# Altium schematic sheet logi-cam.SchDoc: PMOD Camera Adapter
size A; Engineer: Michael Jones; Revision: RA.1; ProjectName: OV7725
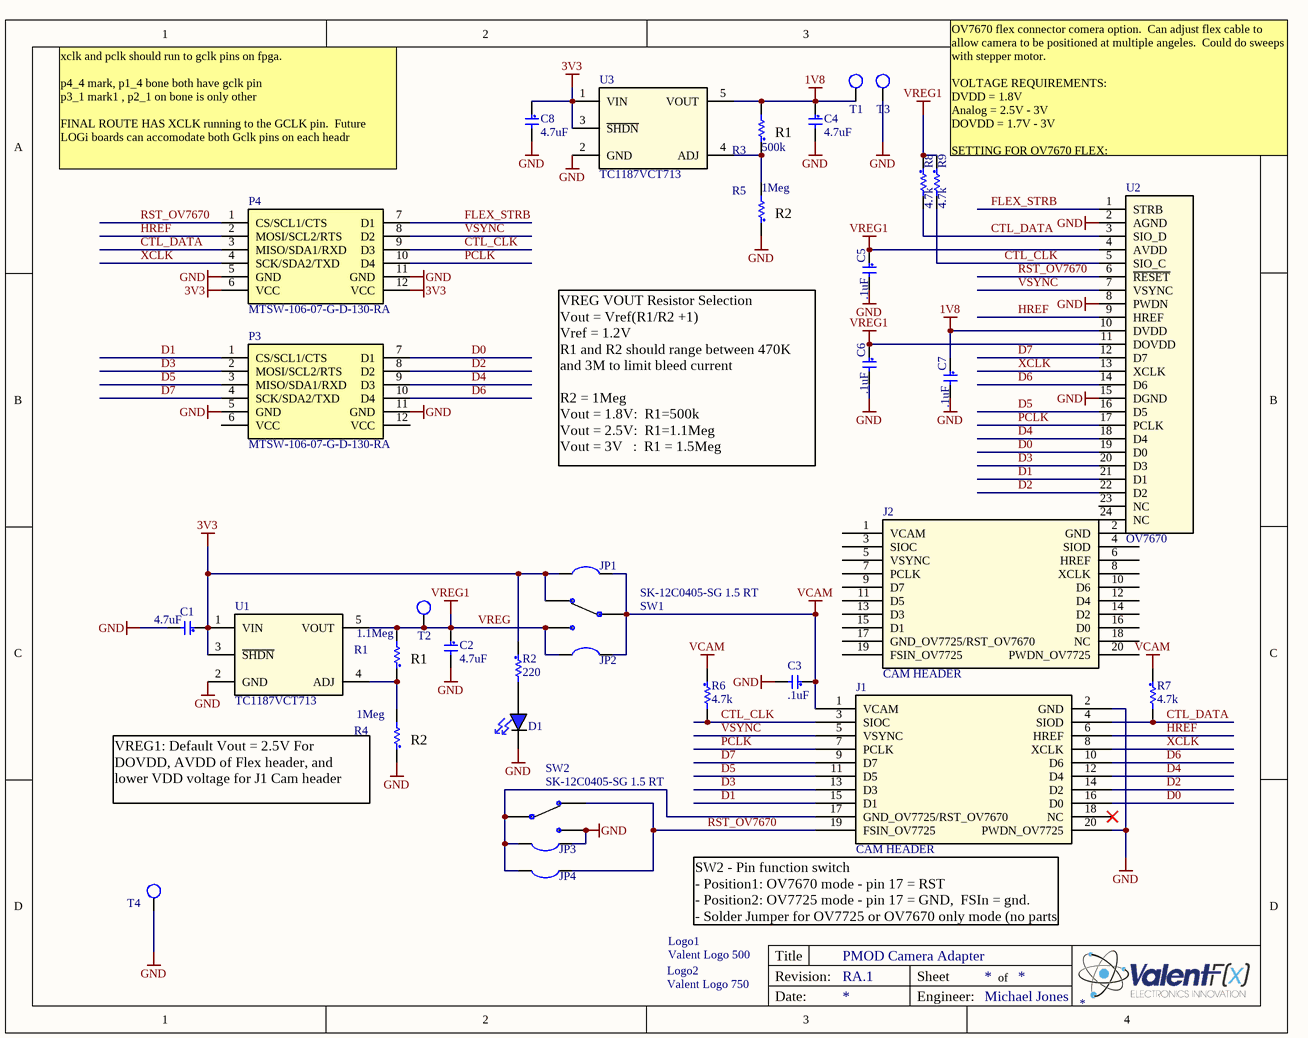
[diagram p0: logi-cam.SchDoc]

## Parts
C1  4.7uF  [C0603]
C2  4.7uF  [C0603]
C3  .1uF  [C0603]
C4  4.7uF  [C0603]
C5  .1uF  [C0603]
C6  .1uF  [C0603]
C7  .1uF  [C0603]
C8  4.7uF  [C0603]
D1  BLUE LED0603  [LED_0603 - BLUE]  (value not drawn)
J1  CAM HEADER  [HEADER_10x2_40_100 1-3-5 THRU DIP]
J2  CAM HEADER  [HEADER_10x2_40_100 1-3-5 THRU DIP]
JP1  Solder Jumper  [SOLDER_JUMPER]  (value not drawn)
JP2  Solder Jumper  [SOLDER_JUMPER]  (value not drawn)
JP3  Solder Jumper  [SOLDER_JUMPER]  (value not drawn)
JP4  Solder Jumper  [SOLDER_JUMPER]  (value not drawn)
Logo1  Valent Logo 500  [ValentFX_500]
Logo2  Valent Logo 750  [ValentFX_750]
P3  MTSW-106-07-G-D-130-RA  [PMOD HEADER - Male]
P4  MTSW-106-07-G-D-130-RA  [PMOD HEADER - Male]
R1  1.1Meg  [R0805]
R2  220  [R0603]
R3  500k  [R0805]
R4  1Meg  [R0805]
R5  1Meg  [R0805]
R6  4.7k  [R0603]
R7  4.7k  [R0603]
R8  4.7k  [R0603]
R9  4.7k  [R0603]
SW1  SK-12C0405-SG 1.5 RT  [SW - SK-12C0405-SG 1.5 RT]
SW2  SK-12C0405-SG 1.5 RT  [SW - SK-12C0405-SG 1.5 RT]
T1  Test Point  [Tp 25-40]  (value not drawn)
T2  Test Point  [Tp 25-40]  (value not drawn)
T3  Test Point  [Tp 25-40]  (value not drawn)
T4  Test Point  [Tp 25-40]  (value not drawn)
U1  TC1187VCT713  [SOT95P280X145-5N - TC2054]
U2  OV7670  [OV7670]
U3  TC1187VCT713  [SOT95P280X145-5N - TC2054]

## Nets
1V8: C4.1 C7.1 R3.2 T1.1 U2.10(DVDD) U3.5(VOUT)
3V3: C1.1 C8.1 JP1.1 P4.6(VCC) P4.12(VCC) R2.1 SW1.2 U1.1(VIN) U1.3(~{SHDN}) U3.1(VIN) U3.3(~{SHDN})
GND: C1.2 C2.2 C3.2 C4.2 C5.2 C6.2 C7.2 C8.2 D1.C J1.2(GND) J1.20(PWDN_OV7725) JP3.1 P3.5(GND) P3.11(GND) P4.5(GND) P4.11(GND) R4.1 R5.1 SW2.3 T3.1 T4.1 U1.2(GND) U2.2(AGND) U2.8(PWDN) U2.15(DGND) U3.2(GND)
VCAM: C3.1 J1.1(VCAM) JP1.2 JP2.2 R6.1 R7.1 SW1.1
VREG: C2.1 C5.1 C6.1 JP2.1 R1.2 R8.1 R9.1 SW1.3 T2.1 U1.5(VOUT) U2.4(AVDD) U2.11(DOVDD)  [also labelled VREG1]
CTL_CLK: J1.3(SIOC) P4.9(D3) R6.2 R9.2 U2.5(SIO_C)
CTL_DATA: J1.4(SIOD) P4.3(MISO/SDA1/RXD) R7.2 R8.2 U2.3(SIO_D)
D0: J1.16(D0) P3.7(D1) U2.19(D0)
D1: J1.15(D1) P3.1(CS/SCL1/CTS) U2.21(D1)
D2: J1.14(D2) P3.8(D2) U2.22(D2)
D3: J1.13(D3) P3.2(MOSI/SCL2/RTS) U2.20(D3)
D4: J1.12(D4) P3.9(D3) U2.18(D4)
D5: J1.11(D5) P3.3(MISO/SDA1/RXD) U2.16(D5)
D6: J1.10(D6) P3.10(D4) U2.14(D6)
D7: J1.9(D7) P3.4(SCK/SDA2/TXD) U2.12(D7)
FLEX_STRB: P4.7(D1) U2.1(STRB)
HREF: J1.6(HREF) P4.2(MOSI/SCL2/RTS) U2.9(HREF)
PCLK: J1.7(PCLK) P4.10(D4) U2.17(PCLK)
RST_OV7670: J1.19(FSIN_OV7725) JP4.1 P4.1(CS/SCL1/CTS) SW2.2 U2.6(~{RESET})
VSYNC: J1.5(VSYNC) P4.8(D2) U2.7(VSYNC)
XCLK: J1.8(XCLK) P4.4(SCK/SDA2/TXD) U2.13(XCLK)
NetD1_A: D1.A R2.2
NetJ1_17: J1.17(GND_OV7725/RST_OV7670) JP3.2 JP4.2 SW2.1
NetR1_1: R1.1 R4.2 U1.4(ADJ)
NetR3_1: R3.1 R5.2 U3.4(ADJ)

Not connected (* = marked no-connect by the designer): J1 18(NC)*; J2 1(VCAM) 2(GND) 3(SIOC) 4(SIOD) 5(VSYNC) 6(HREF) 7(PCLK) 8(XCLK) 9(D7) 10(D6) 11(D5) 12(D4) 13(D3) 14(D2) 15(D1) 16(D0) 17(GND_OV7725/RST_OV7670) 18(NC) 19(FSIN_OV7725) 20(PWDN_OV7725); P3 6(VCC) 12(VCC); U2 23(NC) 24(NC)

## Notes on the sheet
- xclk and pclk should run to gclk pins on fpga.
  p4_4 mark, p1_4 bone both have gclk pin
  p3_1 mark1 , p2_1 on bone is only other
  FINAL ROUTE HAS XCLK running to the GCLK pin.  Future LOGi boards can accomodate both Gclk pins on each headr
- (near R3) R1
- OV7670 flex connector comera option.  Can adjust flex cable to allow camera to be positioned at multiple angeles.  Could do sweeps with stepper motor.
  VOLTAGE REQUIREMENTS:
  DVDD = 1.8V
  Analog = 2.5V - 3V
  DOVDD = 1.7V - 3V
  SETTING FOR OV7670 FLEX:
  SW1 = VREG
  REG2 need to drive DVDD at 1.8V
- (near R5) R2
- VREG VOUT Resistor Selection
  Vout = Vref(R1/R2 +1)
  Vref = 1.2V
  R1 and R2 should range between 470K and 3M to limit bleed current
  R2 = 1Meg
  Vout = 1.8V: 	R1=500k
  Vout = 2.5V: 	R1=1.1Meg
  Vout = 3V   : 	R1 = 1.5Meg
- (near R1) R1
- (near R4) R2
- (near R4) VREG1: Default Vout = 2.5V For DOVDD, AVDD of Flex header, and lower VDD voltage for J1 Cam header
- SW2 - Pin function switch
  - Position1: OV7670 mode - pin 17 = RST
  - Position2: OV7725 mode - pin 17 = GND,  FSIn = gnd.
  - Solder Jumper for OV7725 or OV7670 only mode (no parts needed to populate the board
- Title
- Revision:
- Sheet
- of
- Date:
- Engineer:

## Library data of the parts
C1 C2 C4 C8 = C0603 - GRM188F51A475ZE20D: 4.7uF 10volts Y5V +80-20% (MLCC) - SMD/SMT 0603; Manufacturer: Murata; Tolerance: - 20 %, + 80 %; Supplier 1: Mouser; Manufacturer Part Number: GRM188F51A475ZE20D; RoHS: RoHS Compliant By Exemption; Category: Multilayer Ceramic Capacitors (MLCC) - SMD/SMT; Stock 1: 32662; Pricing 1: 1=0.257, 50=0.159, 100=0.123, 500=0.065, 1000=0.046, 4000=0.032, 8000=0.028, 12000=0.024 (AUD); Capacitance: 4.7 uF; Dimensions: 0.8 mm W x 1.6 mm L x 0.8 mm H; Operating Temperature Range: - 30 C to + 85 C; Package / Case: 0603 (1608 metric); Packaging: Reel; Product: General Type MLCCs; Series: GRM; Termination Style: SMD/SMT; Voltage Rating: 10 Volts; Product Category: High Capacitance SMD Ceramic Chip Capacitors; Standard Pack Qty: 4000; Temperature Coefficient / Code: Y5V; RoHS - Mouser: E; Minimum Order Quantity: 1; Reeling: True; ComponentLink1URL: http://www.murata.com/products/catalog/pdf/c02e.pdf; ComponentLink1Description: http://www.murata.com/products/catalog/pdf/c02e.pdf; Supplier Part Number 1: 81-GRM188F51A475ZE20; Value: 4.7uF
C3 C5-C7 = C0603 - C1608X7R1E104MT: .10uF X7R 20% (MLCC) - SMD/SMT 0603 25volts; Manufacturer: TDK; Capacitance: 0.1 uF; Supplier 1: Mouser; Manufacturer Part Number: C1608X7R1E104MT; RoHS: RoHS Compliant By Exemption; Category: Multilayer Ceramic Capacitors (MLCC) - SMD/SMT; Stock 1: 69148; Pricing 1: 1=0.365, 50=0.149, 100=0.085, 500=0.045, 1000=0.030, 4000=0.027, 8000=0.023, 12000=0.019, 20000=0.018 (AUD); Dimensions: 0.8 mm W x 1.6 mm L; Operating Temperature Range: - 55 C to + 125 C; Package / Case: 0603 (1608 metric); Packaging: Reel; Product: General Type MLCCs; Termination Style: SMD/SMT; Tolerance: 20 %; Voltage Rating: 25 Volts; Product Category: Low & Medium Capacitance SMD Ceramic Chip Capacitors; Standard Pack Qty: 4000.0; Temperature Coefficient / Code: X7R; RoHS - Mouser: E; Minimum Order Quantity: 1; Reeling: True; ComponentLink1URL: http://www.tdk.co.jp/tefe02/e411_c.pdf; ComponentLink1Description: http://www.tdk.co.jp/tefe02/e411_c.pdf; Supplier Part Number 1: 810-C1608X7R1E104M; Value: .1uF
D1 = LED0603 - HT-193NB-5589: BLUE Standard LED - SMD Blue 470nm 40mcd 20mA; Manufacturer: Harvatek International; LED Size: 0603; Lens Shape: Rectangular; Luminous Intensity: 45 mcd; Supplier 1: Mouser; Manufacturer Part Number: HT-193NB-5589; RoHS: RoHS Compliant; Category: Standard LED - SMD; Stock 1: 108922; Pricing 1: 1=0.203, 10=0.176, 50=0.135, 100=0.117, 500=0.101, 1000=0.085, 2000=0.068, 4000=0.068, 5000=0.059, 10000=0.051 (AUD); Illumination Color: Blue; Package / Case: 0603; Packaging: Reel; Wavelength: 470 nm; Lens Dimensions: 1 mm x 0.8 mm; Maximum Operating Temperature: + 80 C; Minimum Operating Temperature: - 30 C; Product Category: Surface Mount LEDs; RoHS - Mouser: Y; Minimum Order Quantity: 1; Reeling: True; ComponentLink1URL: http://harvatekchina.com/specification/HT-193NB.pdf; ComponentLink1Description: http://harvatekchina.com/specification/HT-193NB.pdf; Supplier Part Number 1: 743-HT-193NB-5589; Value: BLUE LED0603
J1 J2 = CAM - DUAL CAMERA HEADER_1: CMOS CAMERA HEADER; ebay store ov7670: shcfstore; supplier link1: http://www.ebay.com/itm/OV7725-high-speed-cmos-QVGA-camera-module-/270973816844?pt=LH_DefaultDomain_0&hash=item3f174c500c; supplier link 2: http://www.ebay.com/itm/180818996795?ssPageName=STRK:MEWNX:IT&_trksid=p3984.m1439.l2649
JP1-JP4 = Solder Jumper: Solder/Configuration Jumper; Manufacturer: n/a; Manufacturer Part Number: n/a; Source: n/a; Source Part Number: n/a; ROHS Certificate: n/a
P3 P4 = P-MOD - MTSW-106-07-G-D-130-RA: Samtec Male Conn Unshrouded Header HDR 12 POS 2.54mm Solder RA Thru-Hole; Lead Time: 0 weeks; Peak Solder Temperature: 260 deg C; MSL (Moisture Sensitivity Level): N/R; Supplier 1: Arrow; Manufacturer: Samtec; Manufacturer Part Number: MTSW-106-07-G-D-130-RA; RoHS: CHINA ROHS: Compliant / EU ROHS: Compliant; Stock 1: 0; Termination Finish: Au/Ni; China ROHS Lead (X -> above / O -> below threshold): O; China ROHS Mercury (X -> above / O -> below threshold): O; China ROHS Cadmium (X -> above / O -> below threshold): O; China ROHS Hex Chromium (X -> above / O -> below threshold): O; China ROHS PBB (X -> above / O -> below threshold): O; China ROHS PBDE (X -> above / O -> below threshold): O; EU_ROHS_PROD_EXEMPTION_BY_SUPP: N/R; ComponentLink1URL: http://components.arrow.com/partservice/dataview/altium/2717179?apiKey=aa438727d59eed98c4bed826d8d949c84cb5e685b92bf87346a0226bd2658797; ComponentLink1Description: http://components.arrow.com/partservice/dataview/altium/2717179?apiKey=aa438727d59eed98c4bed826d8d949c84cb5e685b92bf87346a0226bd2658797; Supplier Part Number 1: 2717179; =Value: MTSW-106-07-G-D-130-RA; Value: MTSW-106-07-G-D-130-RA
R1 R3-R5 = R0603 - ERJ-3EKF1001V: 1Kohms 1% Thick Film Resistors - SMD 0603  Tol; Manufacturer: Panasonic Electronic Components; Power Rating: 0.1 Watt (1/10 Watt); Temperature Coefficient: 100 PPM / C; Product Status: New at Mouser; Value: 1k; Supplier 1: Mouser; Manufacturer Part Number: ERJ-3EKF1001V; RoHS: RoHS Compliant By Exemption; Category: Thick Film Resistors - SMD; Stock 1: 226610; Pricing 1: 1=0.054, 25=0.020, 100=0.014, 250=0.009, 500=0.007, 1000=0.004, 2000=0.003 (AUD); Dimensions: 0.8 mm W x 1.6 mm L x 0.45 mm H; Operating Temperature Range: - 55 C to + 125 C; Package / Case: 0603 (1608 metric); Packaging: Reel; Product: Thick Film Resistors SMD; Resistance: 1 KOhms; Series: ERJ; Termination Style: SMD/SMT; Tolerance: 1 %; Standard Pack Qty: 5000; RoHS - Mouser: E; Minimum Order Quantity: 1; Reeling: True; ComponentLink1URL: http://www.panasonic.com/industrial/components/pdf/AOA0000CE2.pdf; ComponentLink1Description: http://www.panasonic.com/industrial/components/pdf/AOA0000CE2.pdf; Supplier Part Number 1: 667-ERJ-3EKF1001V
R2 = R0603 - ERJ-3EKF2200V: 220 - thick Film Resistors - SMD 0603 220ohms 1% Tol; Manufacturer: Panasonic - ECG; Power (Watts): 0.1W, 1/10W; Temperature Coefficient: ±100ppm/°C; Supplier 1: Digi-Key; Manufacturer Part Number: ERJ-3EKF2200V; RoHS: RoHS Compliant; Category: Resistors; Stock 1: 517798; Pricing 1: 1=0.1, 50=0.0138, 100=0.0105, 250=0.0078, 500=0.00576, 1000=0.00384 (USD); Resistance (Ohms): 220; Composition: Thick Film; Features: -; Tolerance: ±1%; Package / Case: 0603 (1608 Metric); Size / Dimension: 0.063" L x 0.031" W (1.60mm x 0.80mm); Height: 0.022" (0.55mm); Number of Terminations: 2; Packaging: Cut Tape (CT); ComponentLink1URL: http://industrial.panasonic.com/www-cgi/jvcr13pz.cgi?E+PZ+3+AOA0002+ERJ3EKF2200V+7+WW; ComponentLink1Description: http://industrial.panasonic.com/www-cgi/jvcr13pz.cgi?E+PZ+3+AOA0002+ERJ3EKF2200V+7+WW; Supplier Part Number 1: P220HCT-ND; Value: 220
R6-R9 = R0603 - CRCW06034K70FKEA: 4.7k Thick Film Resistors - SMD 1/10watt 4.7Kohms 1%; Manufacturer: Vishay Dale; Power (Watts): 0.1W, 1/10W; Temperature Coefficient: ±100ppm/°C; Supplier 1: Digi-Key; Manufacturer Part Number: CRCW06034K70FKEA; RoHS: RoHS Compliant; Category: Resistors; Stock 1: 51919; Pricing 1: 10=0.081, 50=0.0436, 200=0.0251, 1000=0.01711 (USD); Resistance (Ohms): 4.7K; Composition: Thick Film; Features: -; Tolerance: ±1%; Package / Case: 0603 (1608 Metric); Size / Dimension: 0.061" L x 0.033" W (1.55mm x 0.85mm); Height: 0.020" (0.50mm); Number of Terminations: 2; Packaging: Cut Tape (CT); ComponentLink1URL: http://www.vishay.com/doc?20035; ComponentLink1Description: http://www.vishay.com/doc?20035; Supplier Part Number 1: 541-4.70KHCT-ND; Value: 4.7k
SW1 SW2 = SW - SK-12C0405-SG 1.5 RT: Slide Switches SPDT 0.3 Amp at 4 V; Manufacturer: C&K Components; Contact Rating: 0.3 Amp at 4 VoltsDC; Switch Function: ON - ON; Product Status: New at Mouser; Supplier 1: Mouser; Manufacturer Part Number: SK-12C0405-SG 1.5 RT; RoHS: RoHS Compliant; Category: Slide Switches; Stock 1: 5719; Pricing 1: 1=1.32, 25=1.19, 100=1.13, 250=1.04, 500=0.932, 1000=0.797, 3000=0.687, 6000=0.629 (AUD); Contact Form: SPDT; Packaging: Reel; Termination Style: Gull Wing; Mounting Style: SMD/SMT; RoHS - Mouser: Y; Minimum Order Quantity: 1; Reeling: True; ComponentLink1URL: http://www.mouser.com/catalog/specsheets/SK-12C0405-SG_1.5_RT.pdf; ComponentLink1Description: http://www.mouser.com/catalog/specsheets/SK-12C0405-SG_1.5_RT.pdf; Supplier Part Number 1: 611-SK12C0405SG1.5RT; Value: SK-12C0405-SG 1.5 RT
T1-T4 = Test Point 2: Test Point Smaller Symbol
U1 U3 = REG - TC1187VCT713: IC REG LDO ADJ .15A SOT23A-5; Manufacturer: Microchip Technology; Regulator Topology: Positive Adjustable; Voltage - Output: 1.2 V ~ 5.5 V; Voltage - Input: 2.7 V ~ 6 V; Voltage - Dropout (Typical): 0.27V @ 150mA; Number of Regulators: 1; Current - Output: 150mA (Min); Supplier 1: Digi-Key; Manufacturer Part Number: TC1187VCT713; RoHS: RoHS Compliant; Category: Integrated Circuits (ICs); Stock 1: 0; Pricing 1: 3000=0.32 (USD); Current - Limit (Min): -; Operating Temperature: -40°C ~ 125°C; Mounting Type: Surface Mount; Package / Case: SC-74A, SOT-753; Supplier Device Package: SOT-23-5; Packaging: Tape & Reel (TR); ComponentLink1URL: http://ww1.microchip.com/downloads/en/DeviceDoc/21353E.pdf; ComponentLink1Description: http://ww1.microchip.com/downloads/en/DeviceDoc/21353E.pdf; Value: TC1187VCT713
U2 = OV7670: OV7670 - 24 PIN FFC; ebay_seller: thamesmall; ebay: http://www.ebay.com/itm/640-x-480-CMOS-Camera-Module-OV7670-w-24pin-Socket-2-5V-3-0V-High-Quality-/200870486434?pt=LH_DefaultDomain_0&hash=item2ec4d061a2